# EAGLE design tiffany (EAGLE 7.7.0)
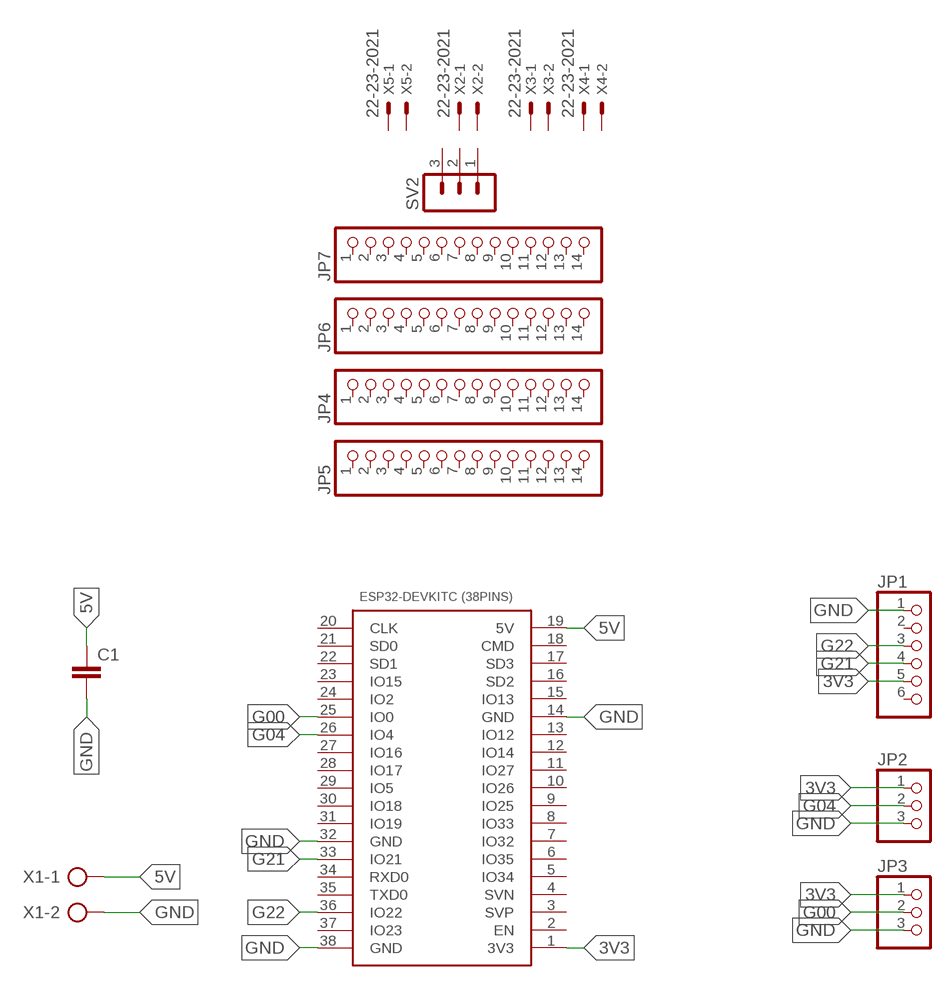
[diagram p0: schematic, sheet 1]

## Parts
C1  C-EU050-024X044  [C050-024X044]
ESP32-DEVKITC(38PINS)1  ESP32DEVKITC_38PINS  [ESP32-DEVKITC]
JP1  PINHD-1X6  [1X06]
JP2  PINHD-1X3  [1X03]
JP3  PINHD-1X3  [1X03]
JP4  PINHD-1X14  [1X14]
JP5  PINHD-1X14  [1X14]
JP6  PINHD-1X14  [1X14]
JP7  PINHD-1X14  [1X14]
SV2  MA03-1  [MA03-1]
X1  AK300/2  [AK300/2]
X2  22-23-2021  [22-23-2021]
X3  22-23-2021  [22-23-2021]
X4  22-23-2021  [22-23-2021]
X5  22-23-2021  [22-23-2021]

## Nets
3V3: ESP32-DEVKITC(38PINS)1.1(3V3) JP1.5 JP2.1 JP3.1
5V: C1.1 ESP32-DEVKITC(38PINS)1.19(5V) X1.1
G00: ESP32-DEVKITC(38PINS)1.25(IO0) JP3.2
G04: ESP32-DEVKITC(38PINS)1.26(IO4) JP2.2
G21: ESP32-DEVKITC(38PINS)1.33(IO21) JP1.4
G22: ESP32-DEVKITC(38PINS)1.36(IO22) JP1.3
GND: C1.2 ESP32-DEVKITC(38PINS)1.14(GND) ESP32-DEVKITC(38PINS)1.32(GND) ESP32-DEVKITC(38PINS)1.38(GND) JP1.1 JP2.3 JP3.3 X1.2
Unconnected: ESP32-DEVKITC(38PINS)1.2(EN) ESP32-DEVKITC(38PINS)1.3(SVP) ESP32-DEVKITC(38PINS)1.4(SVN) ESP32-DEVKITC(38PINS)1.5(IO34) ESP32-DEVKITC(38PINS)1.6(IO35) ESP32-DEVKITC(38PINS)1.7(IO32) ESP32-DEVKITC(38PINS)1.8(IO33) ESP32-DEVKITC(38PINS)1.9(IO25) ESP32-DEVKITC(38PINS)1.10(IO26) ESP32-DEVKITC(38PINS)1.11(IO27) ESP32-DEVKITC(38PINS)1.12(IO14) ESP32-DEVKITC(38PINS)1.13(IO12) ESP32-DEVKITC(38PINS)1.15(IO13) ESP32-DEVKITC(38PINS)1.16(SD2) ESP32-DEVKITC(38PINS)1.17(SD3) ESP32-DEVKITC(38PINS)1.18(CMD) ESP32-DEVKITC(38PINS)1.20(CLK) ESP32-DEVKITC(38PINS)1.21(SD0) ESP32-DEVKITC(38PINS)1.22(SD1) ESP32-DEVKITC(38PINS)1.23(IO15) ESP32-DEVKITC(38PINS)1.24(IO2) ESP32-DEVKITC(38PINS)1.27(IO16) ESP32-DEVKITC(38PINS)1.28(IO17) ESP32-DEVKITC(38PINS)1.29(IO5) ESP32-DEVKITC(38PINS)1.30(IO18) ESP32-DEVKITC(38PINS)1.31(IO19) ESP32-DEVKITC(38PINS)1.34(RXD0) ESP32-DEVKITC(38PINS)1.35(TXD0) ESP32-DEVKITC(38PINS)1.37(IO23) JP1.2 JP1.6 JP4.1 JP4.2 JP4.3 JP4.4 JP4.5 JP4.6 JP4.7 JP4.8 JP4.9 JP4.10 JP4.11 JP4.12 JP4.13 JP4.14 JP5.1 JP5.2 JP5.3 JP5.4 JP5.5 JP5.6 JP5.7 JP5.8 JP5.9 JP5.10 JP5.11 JP5.12 JP5.13 JP5.14 JP6.1 JP6.2 JP6.3 JP6.4 JP6.5 JP6.6 JP6.7 JP6.8 JP6.9 JP6.10 JP6.11 JP6.12 JP6.13 JP6.14 JP7.1 JP7.2 JP7.3 JP7.4 JP7.5 JP7.6 JP7.7 JP7.8 JP7.9 JP7.10 JP7.11 JP7.12 JP7.13 JP7.14 SV2.1 SV2.2 SV2.3 X2.1 X2.2 X3.1 X3.2 X4.1 X4.2 X5.1 X5.2

## Library data of the parts
C1 = rcl:C-EU: CAPACITOR, European symbol
ESP32-DEVKITC(38PINS)1 = ESP32-DEVKITC(38PINS):ESP32DEVKITC
JP1 = adafruit:PINHD-1X6: PIN HEADER
JP2 JP3 = adafruit:PINHD-1X3: PIN HEADER
JP4-JP7 = adafruit:PINHD-1X14: PIN HEADER
SV2 = con-lstb:MA03-1: PIN HEADER; OC_FARNELL: unknown; OC_NEWARK: unknown
X1 = con-ptr500:AK300/2: CONNECTOR; OC_FARNELL: unknown; OC_NEWARK: unknown
X2-X5 = con-molex:22-23-2021: .100" (2.54mm) Center Header - 2 Pin; MF: MOLEX; MPN: 22-23-2021; OC_FARNELL: 1462926; OC_NEWARK: 25C3832

## Board
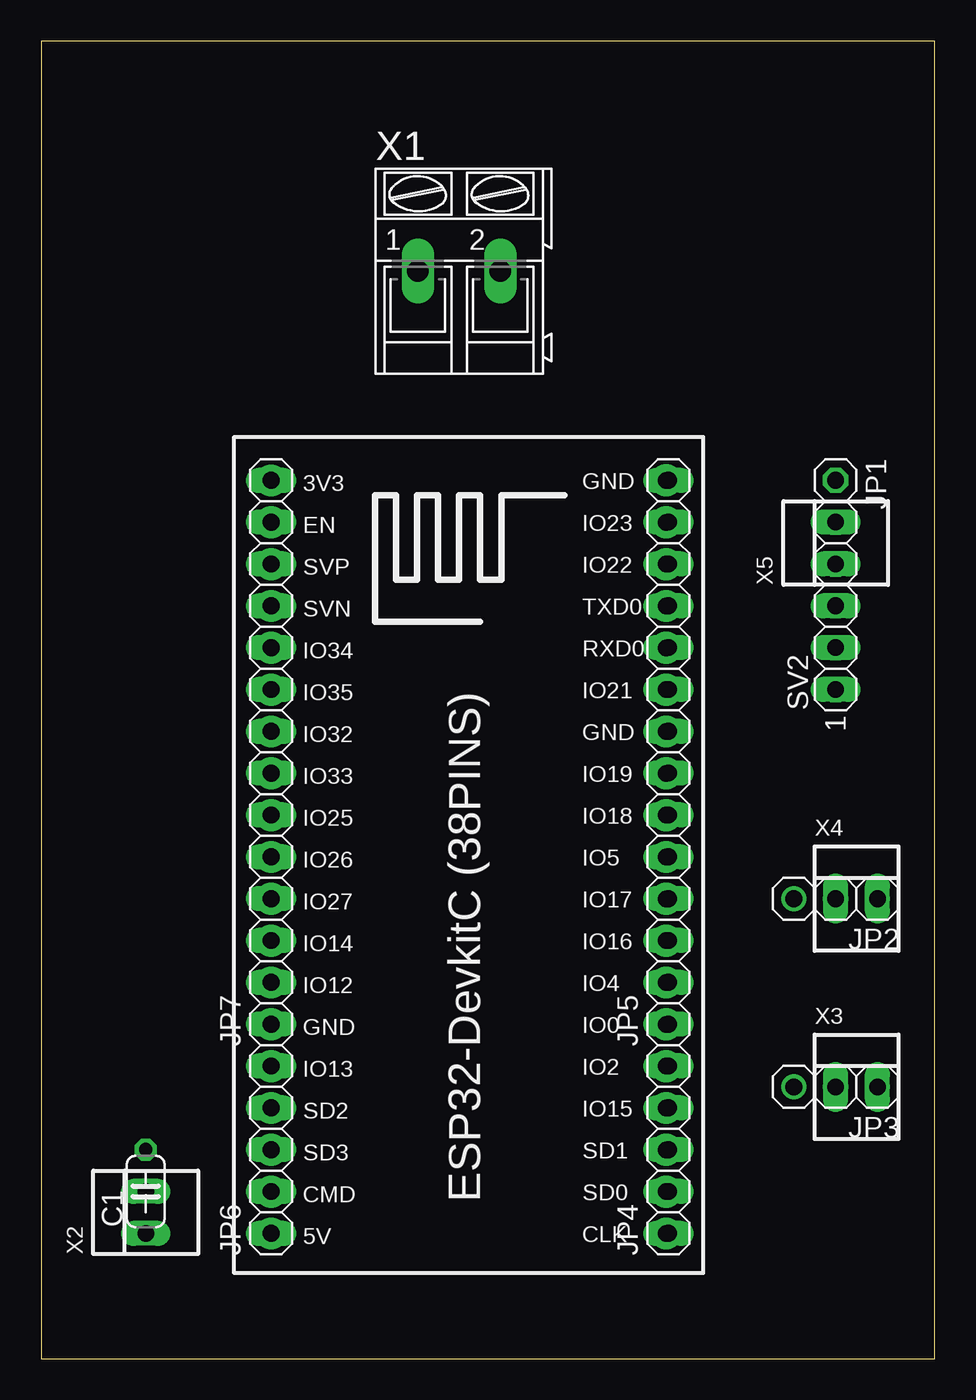
[diagram p1: board, top side]
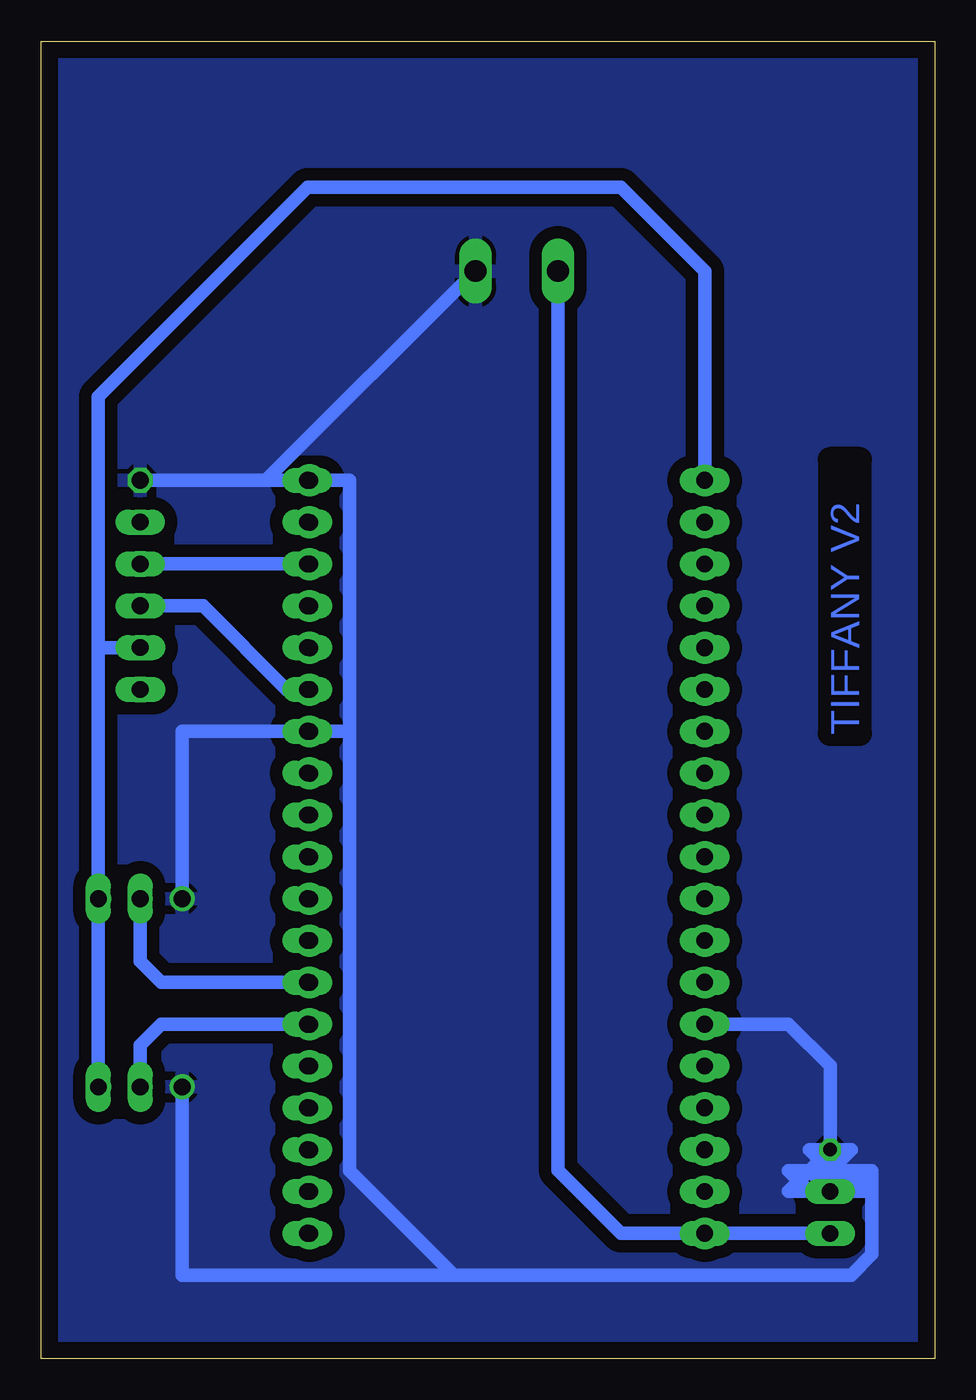
[diagram p2: board, bottom side, seen from below]

Size 54.28 x 80 mm. Coordinates in mm from the lower left corner, seen from the top.
Outline: 0,0 54.28,0 54.28,80 0,80 0,0
Copper layers (1*16): Top 0.035mm / dielectric 1.5mm / Bottom 0.035mm
Design rules "default *": minimum track width 32mil, minimum drill 24mil, track to track 30mil, track to pad 30mil, pad to pad 30mil, via to via 30mil, smd to smd 30mil, copper to edge 40mil, drill to drill 8mil, minimum pad ring 10mil, minimum via ring 8mil, stop-mask expansion 4mil, vias tented up to drill 0mil, thermal gap 10mil

### Footprints (pad centres in the part's own frame; a part is rotated, then mirrored left to right if it is on the bottom)
C050-024X044 = drill 0.813 octagon: 1 -2.54,0; 2 2.54,0
ESP32-DEVKITC = drill 1 pad 1.93: 1 0.01,0; 2 2.55,0; 3 5.09,0; 4 7.63,0; 5 10.17,0; 6 12.71,0; 7 15.25,0; 8 17.79,0; 9 20.33,0; 10 22.87,0; 11 25.41,0; 12 27.95,0; 13 30.49,0; 14 33.03,0; 15 35.57,0; 16 38.11,0; 17 40.65,0; 18 43.19,0; 19 45.73,0; 20 45.73,24; 21 43.19,24; 22 40.65,24; 23 38.11,24; 24 35.57,24; 25 33.03,24; 26 30.49,24; 27 27.95,24; 28 25.41,24; 29 22.87,24; 30 20.33,24; 31 17.79,24; 32 15.25,24; 33 12.71,24; 34 10.17,24; 35 7.63,24; 36 5.09,24; 37 2.55,24; 38 0,24
1X06 = drill 1.016 octagon: 1 -6.35,0; 2 -3.81,0; 3 -1.27,0; 4 1.27,0; 5 3.81,0; 6 6.35,0
1X03 = drill 1.016: 1 -2.54,0; 2 0,0; 3 2.54,0
1X14 = drill 1.016 long: 1 -16.51,0; 2 -13.97,0; 3 -11.43,0; 4 -8.89,0; 5 -6.35,0; 6 -3.81,0; 7 -1.27,0; 8 1.27,0; 9 3.81,0; 10 6.35,0; 11 8.89,0; 12 11.43,0; 13 13.97,0; 14 16.51,0
MA03-1 = drill 1.016 long: 1 -2.54,0; 2 0,0; 3 2.54,0
AK300/2 = drill 1.321 long: 1 -2.515,0; 2 2.489,0
22-23-2021 = drill 1 long: 1 -1.27,0; 2 1.27,0

### Placement (x,y rotation side)
C1  6.35,10.16 90 top
ESP32-DEVKITC(38PINS)1  13.97,53.34 270 top
JP1  48.26,46.99 270 top
JP2  48.26,27.94 180 top
JP3  48.26,16.51 180 top
JP4  38.1,24.13 90 top
JP5  38.1,36.83 90 top
JP6  13.97,24.13 90 top
JP7  13.97,36.83 90 top
SV2  48.26,43.18 90 top
X1  25.4,66.04 0 top
X2  6.35,8.89 90 top
X3  49.53,16.51 0 top
X4  49.53,27.94 0 top
X5  48.26,49.53 90 top

### Tracks (layer width: path | path; a pad name or v marks a point on that pad's centre or on a via)
3V3
  Bottom 0.813: ESP32-DEVKITC(38PINS)1.1 13.97,66.04 19.05,71.12 38.1,71.12 50.8,58.42 50.8,43.18 | 50.8,43.18 JP1.5 | 50.8,43.18 JP2.1 JP3.1
5V
  Bottom 0.813: X1.1 22.89,11.46 19.05,7.62 ESP32-DEVKITC(38PINS)1.19 C1.1
G00
  Bottom 0.813: ESP32-DEVKITC(38PINS)1.25 47,20.31 48.26,19.05 JP3.2
G04
  Bottom 0.813: ESP32-DEVKITC(38PINS)1.26 46.98,22.85 48.26,24.13 JP2.2
G21
  Bottom 0.813: ESP32-DEVKITC(38PINS)1.33 39.36,40.63 44.45,45.72 JP1.4
G22
  Bottom 0.813: JP1.3 38.1,48.26 ESP32-DEVKITC(38PINS)1.36
GND
  Bottom 0.813: ESP32-DEVKITC(38PINS)1.14 8.89,20.32 6.35,17.78 C1.2 7.62,11.43 | 40.64,53.34 ESP32-DEVKITC(38PINS)1.38 35.56,53.34 35.56,38.1 | 40.64,53.34 JP1.1 | 40.64,53.34 27.94,66.04 X1.2 | 35.56,38.1 37.47,38.1 ESP32-DEVKITC(38PINS)1.32 45.72,38.1 JP2.3 | 35.56,38.1 35.56,11.43 29.21,5.08 | 29.21,5.08 5.08,5.08 3.81,6.35 3.81,10.16 | 3.81,10.16 3.81,11.43 | JP3.3 45.72,5.08 29.21,5.08 | 7.62,11.43 8.89,10.16 7.62,10.16 | 3.81,10.16 5.08,10.16 | 5.08,10.16 6.35,10.16 | 6.35,10.16 7.62,10.16 | 7.62,10.16 8.89,11.43 7.62,11.43 | 7.62,11.43 6.35,10.16 | 6.35,10.16 6.35,11.43 | 7.62,11.43 6.35,11.43 | 6.35,11.43 5.08,12.7 7.62,12.7 6.35,11.43 | 5.08,10.16 3.81,11.43 | 3.81,11.43 5.08,11.43 | 5.08,11.43 6.35,11.43 | 6.35,11.43 5.08,10.16 | 5.08,10.16 5.08,11.43
  pour Bottom: 0,0 54.61,0 54.61,80.01 0,80.01

### Text on the board
Bottom: TIFFANY V2 🐧